# Altium schematic sheet Usb_otg_fs.SchDoc
size A4
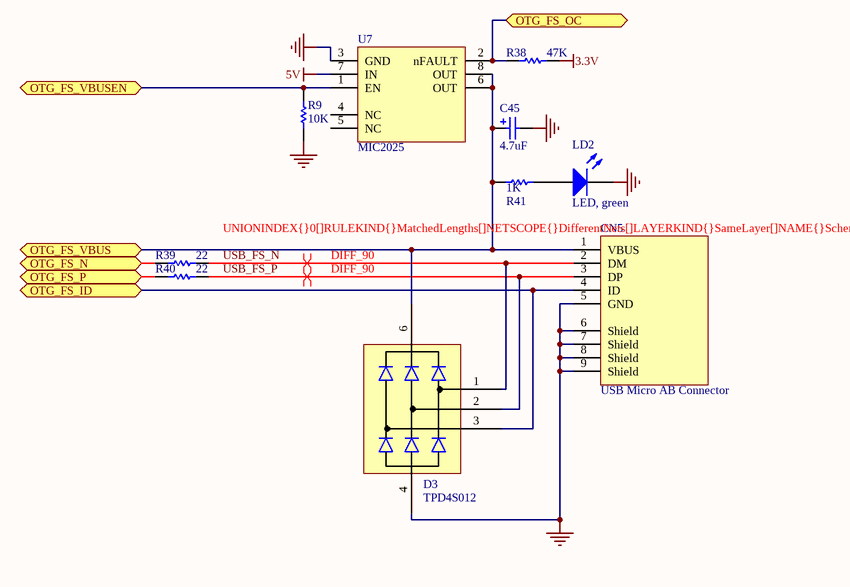
[diagram p0: Usb_otg_fs.SchDoc]

## Parts
C45  value 4.7uF  [TC3216-1206]  (hidden comment: Cap Pol)
CN5  USB Micro AB Connector  [ZX62RD-AB-5P8]
D3  TPD4S012  [SON50P100X60-6M]
LD2  LED, green  [CLED2012-0805]
R9  value 10K  [RESC2012N]  (hidden comment: Res)
R38  value 47K  [RESC2012N]  (hidden comment: 1206)
R39  value 22  [RESC2012N]  (hidden comment: 1206)
R40  value 22  [RESC2012N]  (hidden comment: 1206)
R41  value 1K  [RESC2012N]  (hidden comment: 1206)
U7  MIC2025  [SOIC127P600X173-8M]

## Ports
OTG_FS_ID (bidir), OTG_FS_N (bidir), OTG_FS_OC (bidir), OTG_FS_P (bidir), OTG_FS_VBUS (bidir), OTG_FS_VBUSEN (bidir)

## Nets
3.3V: R38.1
5V: U7.7(IN)
DGND: C45.2 CN5.5(GND) CN5.6(Shield) CN5.7(Shield) CN5.8(Shield) CN5.9(Shield) D3.4 LD2.2(K) R9.2 U7.3(GND)
OTG_FS_ID: CN5.4(ID) D3.3 ; port OTG_FS_ID
OTG_FS_N: R39.2 ; port OTG_FS_N
OTG_FS_OC: R38.2 U7.2(nFAULT) ; port OTG_FS_OC
OTG_FS_P: R40.2 ; port OTG_FS_P
OTG_FS_VBUS: C45.1 CN5.1(VBUS) D3.6 R41.2 U7.6(OUT) U7.8(OUT) ; port OTG_FS_VBUS
OTG_FS_VBUSEN: R9.1 U7.1(EN) ; port OTG_FS_VBUSEN
USB_FS_N: CN5.2(DM) D3.1 R39.1
USB_FS_P: CN5.3(DP) D3.2 R40.1
NetLD2_1: LD2.1(A) R41.1

Not connected (* = marked no-connect by the designer): U7 4(NC) 5(NC)

## Layout directives
differential pair; net class DIFF_90; rule Matched Net Lengths [Tolerance = 150mil]: USB_FS_N, USB_FS_P

## Library data of the parts
C45 = Cap Pol: Polarized Capacitor
CN5 = USB Micro AB Connector: Micro-USB connectors meeting USB 2.0 Standard
D3 = TPD4S012: 4-Channel ESD Solution for USB-HS/USB OTG/USB Charger Interface
LD2 = LED: Light emitting diode
R9 R38-R41 = Res: Resistor
U7 = MIC2025: Single-Channel Power Distribution Switch MM8